# Altium schematic sheet Sheet8.SchDoc
size A4
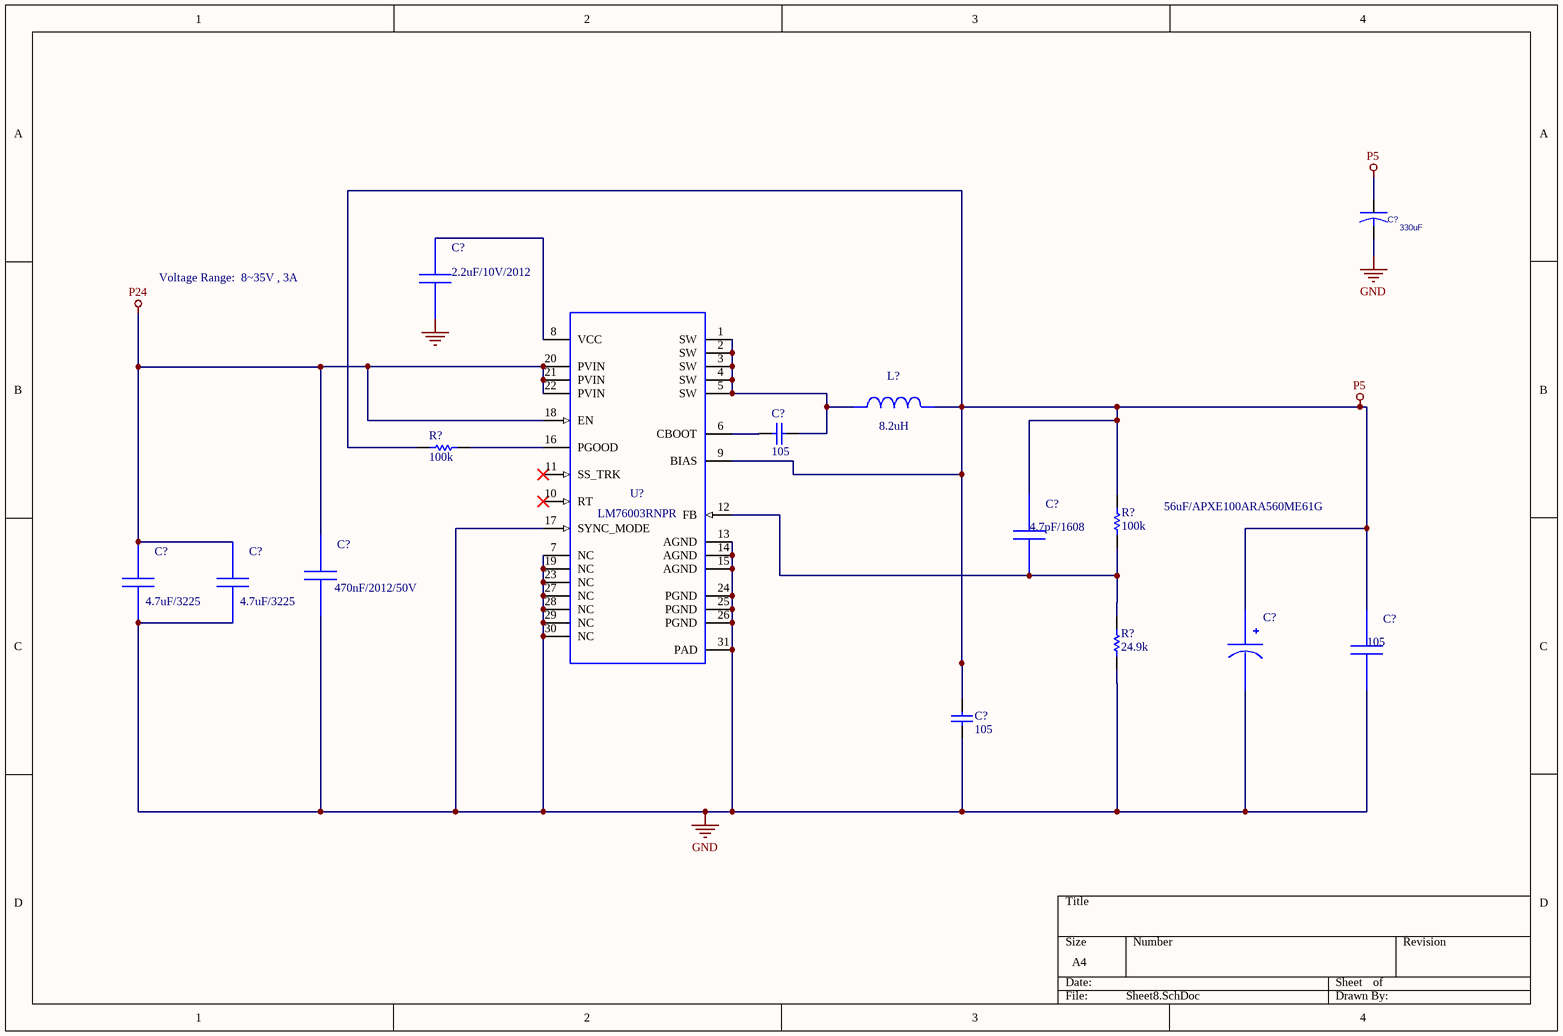
[diagram p0: Sheet8.SchDoc]

## Parts
(Parts that share a designator on the sheet are numbered #1, #2 ... from top to bottom, then left to right.)
C?#1  330uF  [C-전해-CHIP-D8]
C?#2  value 2.2uF/10V/2012  [CAPC2012X05N]  (hidden comment: LMK212B7225KG-T)
C?#3  105  [CAPC1608X05N]
C?#4  4.7pF/1608
C?#5  470nF/2012/50V  [CAPC2012X05N]
C?#6  4.7uF/3225  [CAPC3225X20N]
C?#7  4.7uF/3225  [CAPC3225X20N]
C?#8  56uF/APXE100ARA560ME61G
C?#9  105
C?#10  105  [CAPC1608X05N]
L?  8.2uH
R?#1  100k  [RESC1608X05N]
R?#2  100k  [RESC1608X05N]
R?#3  24.9k  [RESC1608X05N]
U?  LM76003RNPR

## Nets
0: C?#2.2
GND: C?#1.2 C?#5.2 C?#6.2 C?#7.2 C?#8.2(-) C?#9.2 C?#10.2 R?#3.1 U?.7(NC) U?.13(AGND) U?.14(AGND) U?.15(AGND) U?.17(SYNC_MODE) U?.19(NC) U?.23(NC) U?.24(PGND) U?.25(PGND) U?.26(PGND) U?.27(NC) U?.28(NC) U?.29(NC) U?.30(NC) U?.31(PAD)
P5: C?#1.1 C?#4.1 C?#8.1(+) C?#9.1 C?#10.1 L?.2 R?#1.1 R?#2.2 U?.9(BIAS)
P24: C?#5.1 C?#6.1 C?#7.1 U?.18(EN) U?.20(PVIN) U?.21(PVIN) U?.22(PVIN)
NetC?#2_1: C?#2.1 U?.8(VCC)
NetC?#3_1: C?#3.1 L?.1 U?.1(SW) U?.2(SW) U?.3(SW) U?.4(SW) U?.5(SW)
NetC?#3_2: C?#3.2 U?.6(CBOOT)
NetC?#4_2: C?#4.2 R?#2.1 R?#3.2 U?.12(FB)
NetR?#1_2: R?#1.2 U?.16(PGOOD)

Not connected (* = marked no-connect by the designer): U? 10(RT)* 11(SS_TRK)*

## Notes on the sheet
- Voltage Range:  8~35V , 3A

## Library data of the parts
C?#1 = C: OriginalSymbolOrigin: (0,0); COMPHEIGHT: 0.025; MEMORY: NO; COMPGROUP: 0; COMPLOC: [-25.400,22.860]; COMPSIDE: TOP; DECOUPLER: NO; COMPKEY: NO; COMPLOCKED: NO; COMPFIXED: NO; COMPROT: 0; VALUE: 330uF
C?#2 = LMK212B7225KG-T: Manufacturer: Taiyo Yuden; PackageReference: LMK212B7225KG-T; Part Number: LMK212B7225KG-T
C?#3 C?#10 = Cap: Capacitor; Published: 8-Jun-2000; LatestRevisionDate: 17-Jul-2002; LatestRevisionNote: Re-released for DXP Platform.; PackageReference: RAD-0.3; Publisher: Altium Limited; PackageDescription: Radial Cap, Thru-Hole; 2 Leads; 0.3 in Pin Spacing; Value: 105; Part lNumber: *; Manufacturer: *
C?#4 = GRM1555C1E4R7CA01D: GRM1555C1E4R7CA0; Manufacturer: MuRata; Value: 4.7pF; PackageReference: GRM1555C1E4R7CA01D; Part Number: GRM1555C1E4R7CA01D
C?#5 = UMK212BJ474KG-T: Manufacturer: Taiyo Yuden; PackageReference: UMK212BJ474KG-T; Part Number: UMK212BJ474KG-T; Value: 470nF/2012/50V
C?#6 C?#7 = GCM32DC72A475KE02L: GCM32DC72A475KE0; Manufacturer: MuRata; PackageReference: GCM32DC72A475KE02L; Manufacturer: GCM32DC72A475KE02L; Value: 4.7uF/3225
C?#8 = APXE100ARA560ME61G: APXE100ARA560ME6; Manufacturer: Chemi-Con; Value: 56uF; PackageReference: APXE100ARA560ME61G; Part Number: APXE100ARA560ME61G
C?#9 = C1608X6S1H474K080AB: C1608X6S1H474K08; Manufacturer: TDK; PackageReference: C1608X6S1H474K080AB; Part Number: C1608X6S1H474K080AB; Value: 105
L? = XAL6060-822MEB: Manufacturer Name: Coilcraft; PackageReference: XAL6060-822MEB; Manufacturer Part Number: XAL6060-822MEB; Value: 8.2uH
R?#1-R?#3 = Res1: Resistor; Published: 8-Jun-2000; LatestRevisionDate: 17-Jul-2002; LatestRevisionNote: Re-released for DXP Platform.; PackageReference: AXIAL-0.3; Publisher: Altium Limited; PackageDescription: Axial Device, Thru-Hole; 2 Leads; 0.3 in Pin Spacing
  R?#1 R?#2: Value: 100k
  R?#3: Value: 24.9k
U? = LM76003RNPR: Manufacturer Name: Texas Instruments; PackageReference: LM76003RNPR; Manufacturer Part Number: LM76003RNPR; Value: N/A